# Altium project Matrix dot led.PrjPCB
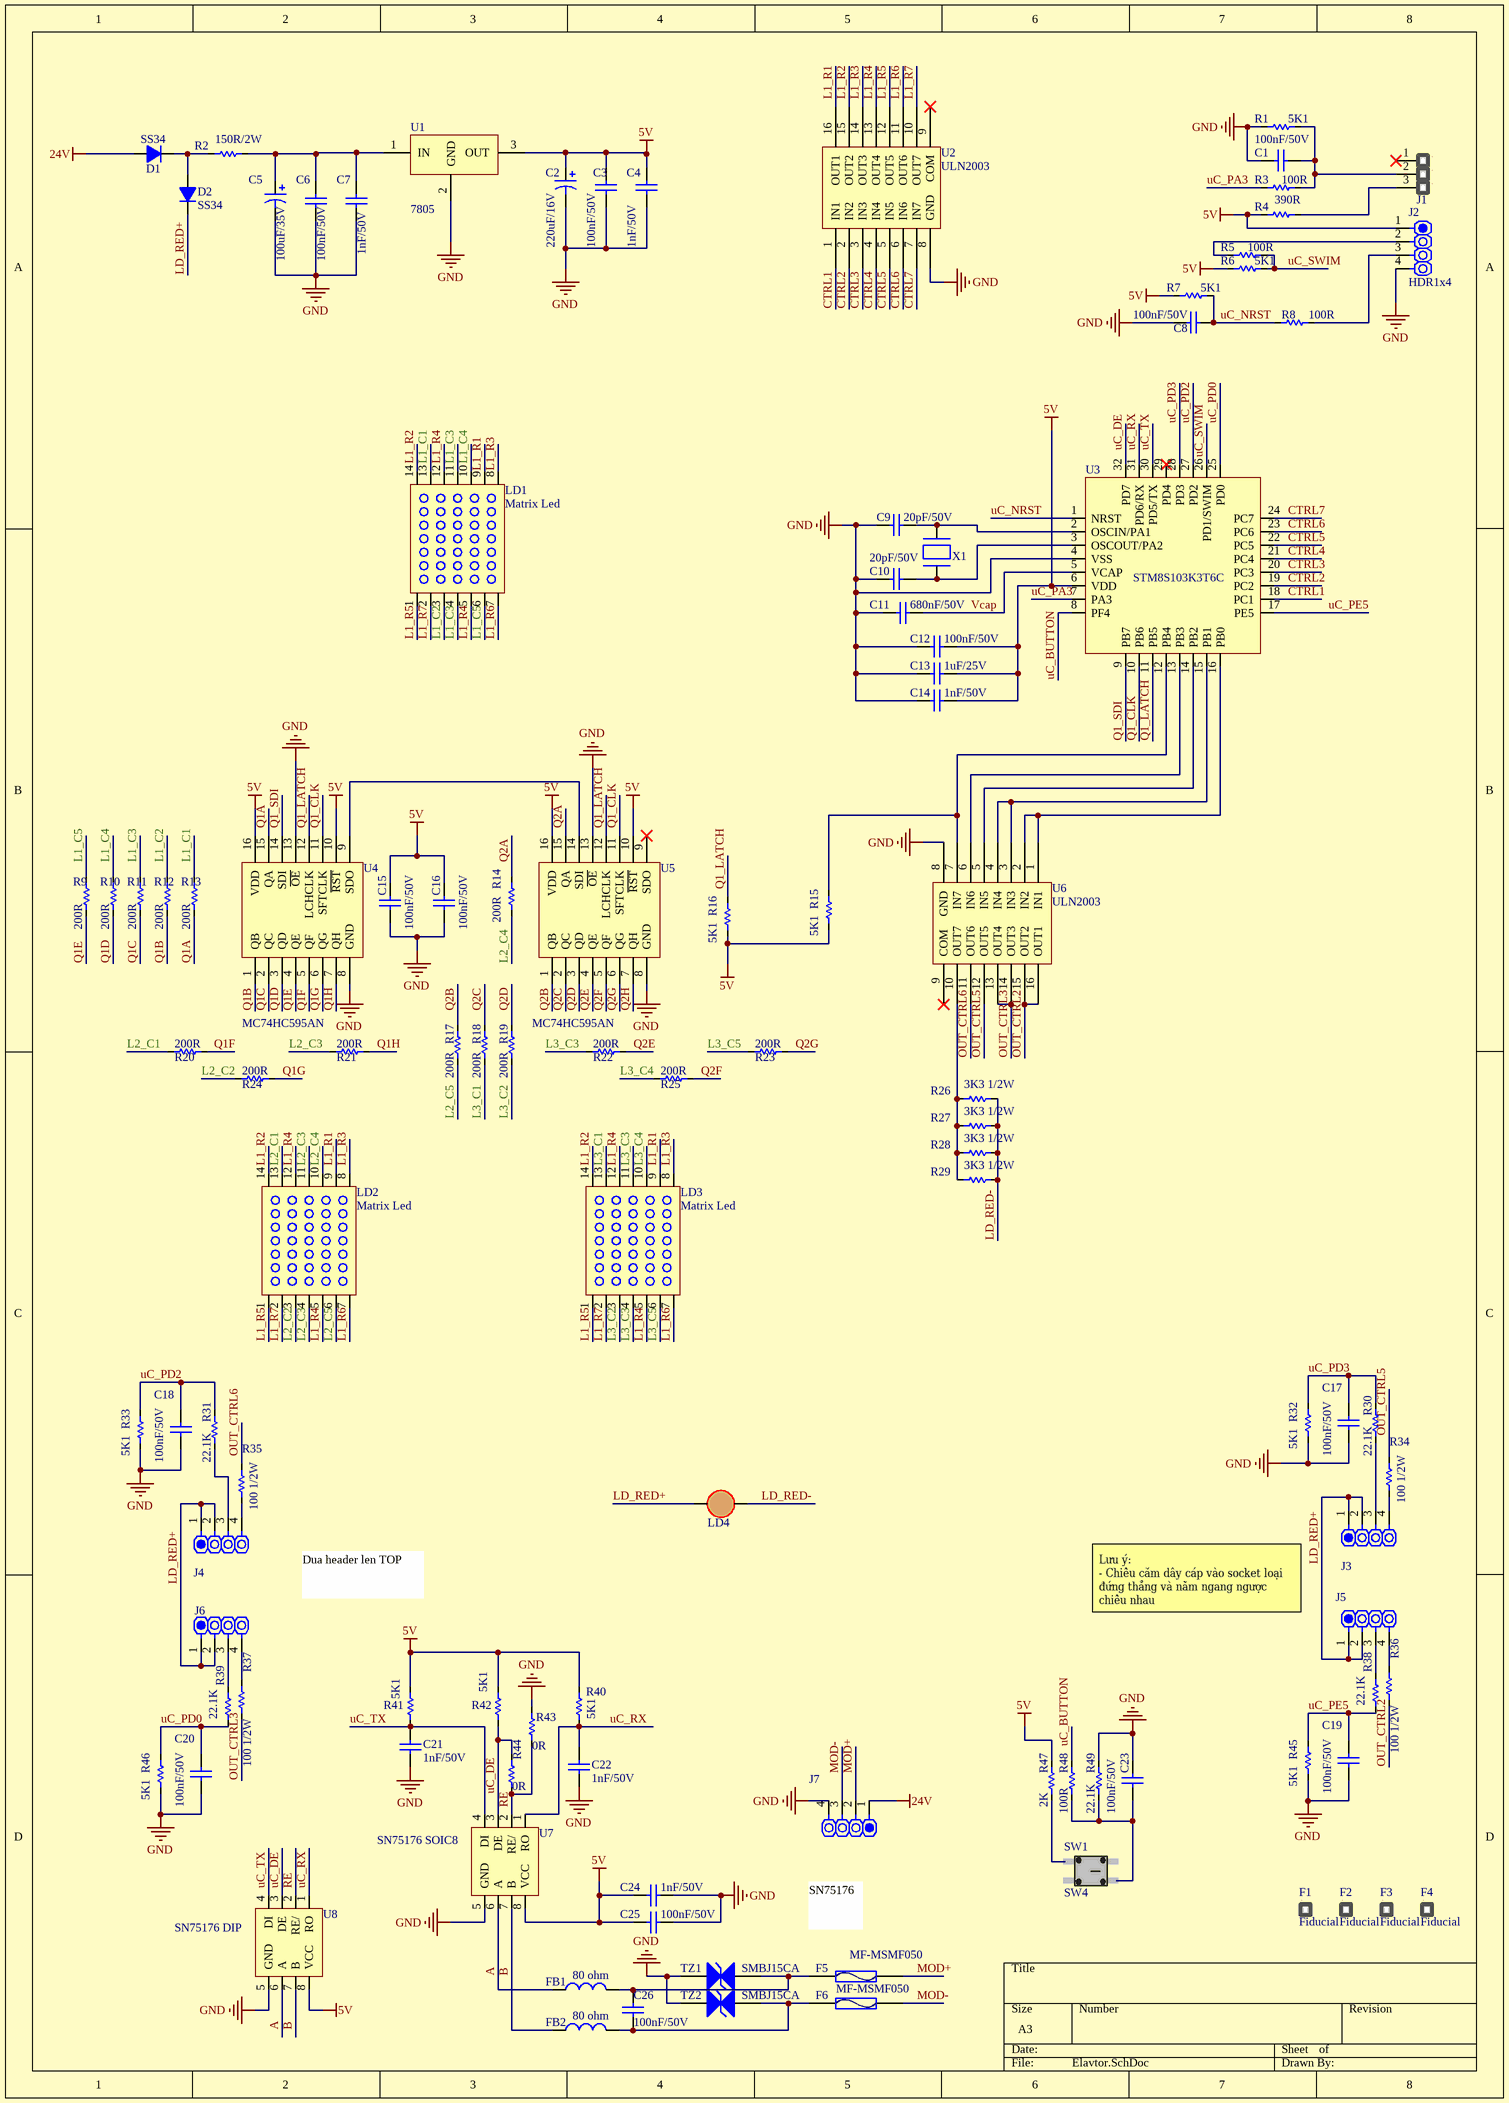
[diagram p0: Elavtor.SchDoc]
1 sheet, 108 parts. Net scope: global (net labels, ports and power ports of the same name join across sheets).
Board file: Elavator Display.PcbDoc

## Sheet Elavtor.SchDoc
size A3 portrait

### Parts
C1  100nF/50V  [CAPC-0603-1608N]
C2  220uF/16V  [CAP.SMD_6.3MM]
C3  100nF/50V  [CAPC-0603-1608N]
C4  1nF/50V  [CAPC-0603-1608N]
C5  100uF/35V  [CAP.SMD_6.3MM]
C6  100nF/50V  [CAPC-0603-1608N]
C7  1nF/50V  [CAPC-0603-1608N]
C8  100nF/50V  [CAPC-0603-1608N]
C9  20pF/50V  [CAPC-0603-1608N]
C10  20pF/50V  [CAPC-0603-1608N]
C11  680nF/50V  [CAPC-0603-1608N]
C12  100nF/50V  [CAPC-0603-1608N]
C13  1uF/25V  [CAPC-0603-1608N]
C14  1nF/50V  [CAPC-0603-1608N]
C15  100nF/50V  [CAPC-0603-1608N]
C16  100nF/50V  [CAPC-0603-1608N]
C17  100nF/50V  [CAPC-0603-1608N]
C18  100nF/50V  [CAPC-0603-1608N]
C19  100nF/50V  [CAPC-0603-1608N]
C20  100nF/50V  [CAPC-0603-1608N]
C21  1nF/50V  [CAPC-0603-1608N]
C22  1nF/50V  [CAPC-0603-1608N]
C23  100nF/50V  [CAPC-0603-1608N]
C24  1nF/50V  [CAPC-0603-1608N]
C25  100nF/50V  [CAPC-0603-1608N]
C26  100nF/50V  [CAPC-0603-1608N]
D1  SS34  [DO-214AC,SMA]
D2  SS34  [DO-214AC,SMA]
F1  Fiducial  [Fiducial]
F2  Fiducial  [Fiducial]
F3  Fiducial  [Fiducial]
F4  Fiducial  [Fiducial]
F5  MF-MSMF050  [FUSE PTC 1812]
F6  MF-MSMF050  [FUSE PTC 1812]
FB1  80 ohm  [L_0805]
FB2  80 ohm  [L_0805]
J1  HDR1x3  [HDR1X3]  (value not drawn)
J2  HDR1x4  [HDR1X4]
J3  HDR1x4  [Hdr1x4 R Box]  (value not drawn)
J4  HDR1x4  [Hdr1x4 R Box]  (value not drawn)
J5  HDR1x4  [Hdr1x4 R Box]  (value not drawn)
J6  HDR1x4  [Hdr1x4 R Box]  (value not drawn)
J7  HDR1x4  [Hdr1x4 R Box]  (value not drawn)
LD1  Matrix Led  [LED_Matrix 5*7]
LD2  Matrix Led  [LED_Matrix 5*7]
LD3  Matrix Led  [LED_Matrix 5*7]
LD4  LED TH 33x22 mm  [LED. 33x22 mm]  (value not drawn)
R1  5K1  [R.SMD_0603]
R2  150R/2W  [Resistor 1.5-2w]
R3  100R  [R.SMD_0603]
R4  390R  [R.SMD_0603]
R5  100R  [R.SMD_0603]
R6  5K1  [R.SMD_0603]
R7  5K1  [R.SMD_0603]
R8  100R  [R.SMD_0603]
R9  200R  [R.SMD_0603]
R10  200R  [R.SMD_0603]
R11  200R  [R.SMD_0603]
R12  200R  [R.SMD_0603]
R13  200R  [R.SMD_0603]
R14  200R  [R.SMD_0603]
R15  5K1  [R.SMD_0603]
R16  5K1  [R.SMD_0603]
R17  200R  [R.SMD_0603]
R18  200R  [R.SMD_0603]
R19  200R  [R.SMD_0603]
R20  200R  [R.SMD_0603]
R21  200R  [R.SMD_0603]
R22  200R  [R.SMD_0603]
R23  200R  [R.SMD_0603]
R24  200R  [R.SMD_0603]
R25  200R  [R.SMD_0603]
R26  3K3 1/2W  [R.SMD_1210]
R27  3K3 1/2W  [R.SMD_1210]
R28  3K3 1/2W  [R.SMD_1210]
R29  3K3 1/2W  [R.SMD_1210]
R30  22.1K  [R.SMD_0603]
R31  22.1K  [R.SMD_0603]
R32  5K1  [R.SMD_0603]
R33  5K1  [R.SMD_0603]
R34  100 1/2W  [R.SMD_1210]
R35  100 1/2W  [R.SMD_1210]
R36  100 1/2W  [R.SMD_1210]
R37  100 1/2W  [R.SMD_1210]
R38  22.1K  [R.SMD_0603]
R39  22.1K  [R.SMD_0603]
R40  5K1  [R.SMD_0603]
R41  5K1  [R.SMD_0603]
R42  5K1  [R.SMD_0603]
R43  0R  [R.SMD_0603]
R44  0R  [R.SMD_0603]
R45  5K1  [R.SMD_0603]
R46  5K1  [R.SMD_0603]
R47  2K  [R.SMD_0603]
R48  100R  [R.SMD_0603]
R49  22.1K  [R.SMD_0603]
SW1  SW4  [SW4 SMALL]
TZ1  SMBJ15CA  [DO-214AA,SMB]
TZ2  SMBJ15CA  [DO-214AA,SMB]
U1  7805  [TO-252]
U2  ULN2003  [SOIC16_150_N]
U3  STM8S103K3T6C  [LQFP32]
U4  MC74HC595AN  [SOIC16_150_N]
U5  MC74HC595AN  [SOIC16_150_N]
U6  ULN2003  [SOIC16_150_N]
U7  SN75176 SOIC8  [SOIC8 - JEDEC]
U8  SN75176 DIP  [DIP8/W0.3]
X1  16MHz  [CRYSTAL]  (value not drawn)

### Nets
5V: C2.1(+) C3.2 C4.1 C12.2 C13.2 C14.2 C15.2 C16.2 C24.1 C25.2 J2.1 R4.2 R6.1 R7.1 R15.2 R16.2 R40.1 R41.1 R42.1 R47.1 U1.3(OUT) U3.6(VDD) U4.10(~{RST}) U4.16(VDD) U5.10(~{RST}) U5.16(VDD) U7.8(VCC) U8.8(VCC)
24V: D1.1(A) J7.1
GND: C1.2 C2.2(-) C3.1 C4.2 C5.2(-) C6.1 C7.2 C8.2 C9.1 C10.1 C11.2 C12.1 C13.1 C14.1 C15.1 C16.1 C17.1 C18.1 C19.1 C20.1 C21.1 C22.1 C23.2 C24.2 C25.1 J2.4 J7.4 R1.1 R32.2 R33.2 R43.1 R45.2 R46.2 R49.1 TZ1.2 TZ2.2 U1.2(GND) U2.8(GND) U3.4(VSS) U4.8(GND) U4.13(~{OE}) U5.8(GND) U5.13(~{OE}) U6.8(GND) U7.5(GND) U8.5(GND)
A: FB1.1 U7.6(A) U8.6(A)
B: FB2.1 U7.7(B) U8.7(B)
CTRL1: U2.1(IN1) U3.18(PC1)
CTRL2: U2.2(IN2) U3.19(PC2)
CTRL3: U2.3(IN3) U3.20(PC3)
CTRL4: U2.4(IN4) U3.21(PC4)
CTRL5: U2.5(IN5) U3.22(PC5)
CTRL6: U2.6(IN6) U3.23(PC6)
CTRL7: U2.7(IN7) U3.24(PC7)
L1_C1: LD1.13 R13.2
L1_C2: LD1.3 R12.2
L1_C3: LD1.4 LD1.11 R11.2
L1_C4: LD1.10 R10.2
L1_C5: LD1.6 R9.2
L1_R1: LD1.9 LD2.9 LD3.9 U2.16(OUT1)
L1_R2: LD1.14 LD2.14 LD3.14 U2.15(OUT2)
L1_R3: LD1.8 LD2.8 LD3.8 U2.14(OUT3)
L1_R4: LD1.5 LD1.12 LD2.5 LD2.12 LD3.5 LD3.12 U2.13(OUT4)
L1_R5: LD1.1 LD2.1 LD3.1 U2.12(OUT5)
L1_R6: LD1.7 LD2.7 LD3.7 U2.11(OUT6)
L1_R7: LD1.2 LD2.2 LD3.2 U2.10(OUT7)
L2_C1: LD2.13 R20.2
L2_C2: LD2.3 R24.2
L2_C3: LD2.4 LD2.11 R21.2
L2_C4: LD2.10 R14.1
L2_C5: LD2.6 R17.1
L3_C1: LD3.13 R18.1
L3_C2: LD3.3 R19.1
L3_C3: LD3.4 LD3.11 R22.2
L3_C4: LD3.10 R25.2
L3_C5: LD3.6 R23.2
LD_RED+: D2.2(K) J3.1 J3.2 J4.1 J4.2 J5.1 J5.2 J6.1 J6.2 LD4.1(A)
LD_RED-: LD4.2(K) R26.2 R27.2 R28.2 R29.2
MOD+: F5.2 J7.2
MOD-: F6.2 J7.3
OUT_CTRL2: R36.1 U6.15(OUT2) U6.16(OUT1)
OUT_CTRL3: R37.1 U6.13(OUT4) U6.14(OUT3)
OUT_CTRL5: R34.2 U6.12(OUT5)
OUT_CTRL6: R35.2 U6.11(OUT6)
Q1_CLK: U3.10(PB6) U4.11(SFTCLK) U5.11(SFTCLK)
Q1_LATCH: R16.1 U3.11(PB5) U4.12(LCHCLK) U5.12(LCHCLK)
Q1_SDI: U3.9(PB7) U4.14(SDI)
Q1A: R13.1 U4.15(QA)
Q1B: R12.1 U4.1(QB)
Q1C: R11.1 U4.2(QC)
Q1D: R10.1 U4.3(QD)
Q1E: R9.1 U4.4(QE)
Q1F: R20.1 U4.5(QF)
Q1G: R24.1 U4.6(QG)
Q1H: R21.1 U4.7(QH)
Q2A: R14.2 U5.15(QA)
Q2B: R17.2 U5.1(QB)
Q2C: R18.2 U5.2(QC)
Q2D: R19.2 U5.3(QD)
Q2E: R22.1 U5.4(QE)
Q2F: R25.1 U5.5(QF)
Q2G: R23.1 U5.6(QG)
Q2H: U5.7(QH)
RE: R43.2 R44.2 U7.2(RE/) U8.2(RE/)
uC_BUTTON: R48.1 U3.8(PF4)
uC_DE: R42.2 R44.1 U3.32(PD7) U7.3(DE) U8.3(DE)
uC_NRST: C8.1 R7.2 R8.2 U3.1(NRST)
uC_PA3: R3.2 U3.7(PA3)
uC_PD0: C20.2 R39.2 R46.1 U3.25(PD0)
uC_PD2: C18.2 R31.1 R33.1 U3.27(PD2)
uC_PD3: C17.2 R30.1 R32.1 U3.28(PD3)
uC_PE5: C19.2 R38.2 R45.1 U3.17(PE5)
uC_RX: C22.2 R40.2 U3.31(PD6/RX) U7.1(RO) U8.1(RO)
uC_SWIM: R5.1 R6.2 U3.26(PD1/SWIM)
uC_TX: C21.2 R41.2 U3.30(PD5/TX) U7.4(DI) U8.4(DI)
Vcap: C11.1 U3.5(VCAP)
NetC1_1: C1.1 J1.2 R1.2 R3.1
NetC5_1: C5.1(+) C6.2 C7.1 R2.2 U1.1(IN)
NetC9_2: C9.2 U3.2(OSCIN/PA1) X1.2
NetC10_2: C10.2 U3.3(OSCOUT/PA2) X1.1
NetC23_1: C23.1 R48.2 R49.2 SW1.2
NetC26_1: C26.1 F5.1 FB1.2 TZ1.1
NetC26_2: C26.2 F6.1 FB2.2 TZ2.1
NetD1_2: D1.2(K) D2.1(A) R2.1
NetJ1_3: J1.3 R4.1
NetJ2_2: J2.2 R5.2
NetJ2_3: J2.3 R8.1
NetJ3_3: J3.3 R30.2
NetJ3_4: J3.4 R34.1
NetJ4_3: J4.3 R31.2
NetJ4_4: J4.4 R35.1
NetJ5_3: J5.3 R38.1
NetJ5_4: J5.4 R36.2
NetJ6_3: J6.3 R39.1
NetJ6_4: J6.4 R37.2
NetR15_1: R15.1 U3.12(PB4) U6.7(IN7)
NetR26_1: R26.1 R27.1 R28.1 R29.1 U6.10(OUT7)
NetR47_2: R47.2 SW1.4
NetU3_13: U3.13(PB3) U6.6(IN6)
NetU3_14: U3.14(PB2) U6.5(IN5)
NetU3_15: U3.15(PB1) U6.3(IN3) U6.4(IN4)
NetU3_16: U3.16(PB0) U6.1(IN1) U6.2(IN2)
NetU4_9: U4.9(SDO) U5.14(SDI)

Not connected (* = marked no-connect by the designer): J1 1*; SW1 1 3; U2 9(COM)*; U3 29(PD4)*; U5 9(SDO)*; U6 9(COM)*

### Notes on the sheet
- Dua header len TOP
- Lưu ý:
  - Chiều cắm dây cáp vào socket loại đứng thẳng và nằm ngang ngược chiều nhau
- SN75176

### Library data of the parts
C1 C3 C6 C8 C12 C15-C20 C23 C25 C26 = Cap Ceramic: CAP CER 100nF 50V 0603
C2 C5 = Cap Pol 2mm: Cap Pol 100uF 35V  SMD 6.3x7.7 mm; Value: 10uF; Published: 8-Jun-2000; LatestRevisionDate: 17-Jul-2002; LatestRevisionNote: Re-released for DXP Platform.; PackageReference: POLAR0.8; Publisher: Altium Limited
C4 C7 C14 C22 C24 = Cap Ceramic: CAP CER 1nF 50V 0603
C9 C10 = Cap Ceramic: CAP CER 20pF 50V 0603
C11 = Cap Ceramic: CAP CER 680nF 50V 0603
C13 = Cap Ceramic: CAP CER 1uF 25V 0603
C21 = Cap Ceramic: CAP CER 1nF 50V 0805
D1 D2 = Diode: SS34 SMA; Part name: *; Part number: *; Manufacturer: *; Package: *
F1-F4 = Fiducial: SMT Fiducial
F5 F6 = Fuse 1: Surface Mount Fuse 1A/250V; Manufacturer: Bourns Inc; Part name: PTC RESET FUSE 15V 0.5A 2016; Part Package: 1812 (4532); Supplier: VN; Part number: MF-MSMF050; Value: MF-MSMF050
FB1 FB2 = Inductor: Ferrite Bead 80 Ohm @100MHz nductor 0805; Package: *; Manufacturer: *; Part number: *; Part name: *
J1 = HDR 1x3: 2.54mm 3x1 Single Male Pin Header; Vendor: Nhat Tao; ComponentLink1Description: Digikey Part link; ComponentLink2Description: Open DataSheet; Date of Price: 19/11/2010; Price: 500 VND
J2 = HDR 1x4: 2.54mm 4x1 Single Male Pin Header; Manufacturer: Taiwan; Part number: HEADER1X4; Part name: 2.54mm-4x1-MH; Package: SIP4
J3-J7 = HDR 1x4: 5.08mm 4x1 Single Male RIght pin Header; Manufacturer: Taiwan; Part number: HEADER1X4; Part name: 2.54mm-4x1-MH; Package: SIP4
LD1-LD3 = Matrix Led 5x7
LD4 = LED SINGLE: Manufacturer: Harvatek Technologies; Part name: LED-0805-RED; Part number: HT17-2102SURC; Package: 0805
R1 R6 R7 R15 R16 R32 R33 R40-R42 R45 R46 = Resistor 1/4W: RES SMD 5K1 OHM 5% 1/8W 0603; Manufacturer: SUPEROHM; Part name: R 0603 1K 5%; Part number: RR1608(0603)L102JT; Package: 0603
R2 = Resistor 1/4W: RES SMD 150R OHM 5% 2W TH; Manufacturer: SUPEROHM; Part name: R 0603 1K 5%; Part number: RR1608(0603)L102JT; Package: 0603
R3 R5 = Resistor 1/4W: RES SMD 100R OHM 1% 1/8W 0603; Manufacturer: SUPEROHM; Part name: R 0603 1K 5%; Part number: RR1608(0603)L102JT; Package: 0603
R4 = Resistor 1/4W: RES SMD 390R OHM 5% 1/8W 0603; Manufacturer: SUPEROHM; Part name: R 0603 1K 5%; Part number: RR1608(0603)L102JT; Package: 0603
R8 R48 = Resistor 1/4W: RES SMD 100R OHM 1% 1/10W 0603; Manufacturer: SUPEROHM; Part name: R 0603 1K 5%; Part number: RR1608(0603)L102JT; Package: 0603
R9-R14 R17-R25 = Resistor 1/4W: RES SMD 200R OHM 5% 180W 0603; Manufacturer: SUPEROHM; Part name: R 0603 1K 5%; Part number: RR1608(0603)L102JT; Package: 0603
R26-R29 = Resistor 1/4W: RES SMD 3K3 OHM 5% 1/2W 1210; Manufacturer: SUPEROHM; Part name: R 0603 1K 5%; Part number: RR1608(0603)L102JT; Package: 0603
R30 R31 R38 R39 R49 = Resistor 1/4W: RES SMD 22.1K OHM 5% 1/8W 0603; Manufacturer: SUPEROHM; Part name: R 0603 1K 5%; Part number: RR1608(0603)L102JT; Package: 0603
R34-R37 = Resistor 1/4W: RES SMD 100 OHM 5% 1/2W 1210; Manufacturer: SUPEROHM; Part name: R 0603 1K 5%; Part number: RR1608(0603)L102JT; Package: 0603
R43 R44 = Resistor 1/4W: RES SMD 0R OHM 1% 1/10W 0603; Manufacturer: SUPEROHM; Part name: R 0603 1K 5%; Part number: RR1608(0603)L102JT; Package: 0603
R47 = Resistor 1/4W: RES SMD 2K OHM 5% 1/8W 0603; Manufacturer: SUPEROHM; Part name: R 0603 1K 5%; Part number: RR1608(0603)L102JT; Package: 0603
SW1 = SW4: Tact Switch 6x6x5 Black; Part number: KAN0611-0501B; Manufacturer: *; Part name: Tact Switch 6x6x5 Black; Package: DIP 4
TZ1 TZ2 = TVS: Manufacturer: ON Semi; Part name: TVS DIODE 15V 24.4V DO214AA; Supplier: Digikey; Part Number: SMBJ15CA; Part Package: DO-214AA,SMB; Value: SMBJ15CA
U1 = 78XX: LM7805 SMD TO-252; Value: 7805
U2 U6 = ULN2003: High-Current Darlington Transistor Arrays; Manufacturer: Texas instruments; Part number: *
U3 = STM8S103K3T6C: 16 MHz STM8S 8-bit MCU, up to 8 Kbytes Flash, data / EEPROM,10-bit ADC, 3 timers, UART, SPI, I²C
U4 U5 = MC74HC595AN: 8-Bit Serial-Input/Serial or Prallel-Output Shift Register with Latched 3-State Outputs; Published: 15-Apr-2002; DatasheetVersion: Mar-2000; PackageVersion: Apr-2000; PackageReference: 648-08; Publisher: Altium Limited; PackageDescription: DIP; 16 Leads; Row Spacing 7.62 mm; Pitch 2.54 mm; Code_JEDEC: MS-001-BB; ComponentLink1Description: Manufacturer Link; ComponentLink1URL: http://www.onsemi.com/; ComponentLink2Description: Datasheet; ComponentLink2URL: http://www.onsemi.com/pub/Collateral/MC74HC595A-D.PDF
U7 = RS485: SN65HVD3082E; Part Number: SP485; Manufacturer: *; Supplier: VN
U8 = RS485: SOCKET DIP 8; Part Number: SP485; Manufacturer: *; Supplier: VN
X1 = CRYSTAL: CRYSTAL 16MHz 7PF SMD; Package: *; Part name: *; Manufacturer: *; Part number: *

## Assembly variants
Variant of Matrix dot led: not fitted C9 C10 LD4 R34 R35 R36 R37 R44 U7 X1